# EAGLE design IvoOerlikon2 (EAGLE 7.6.0)
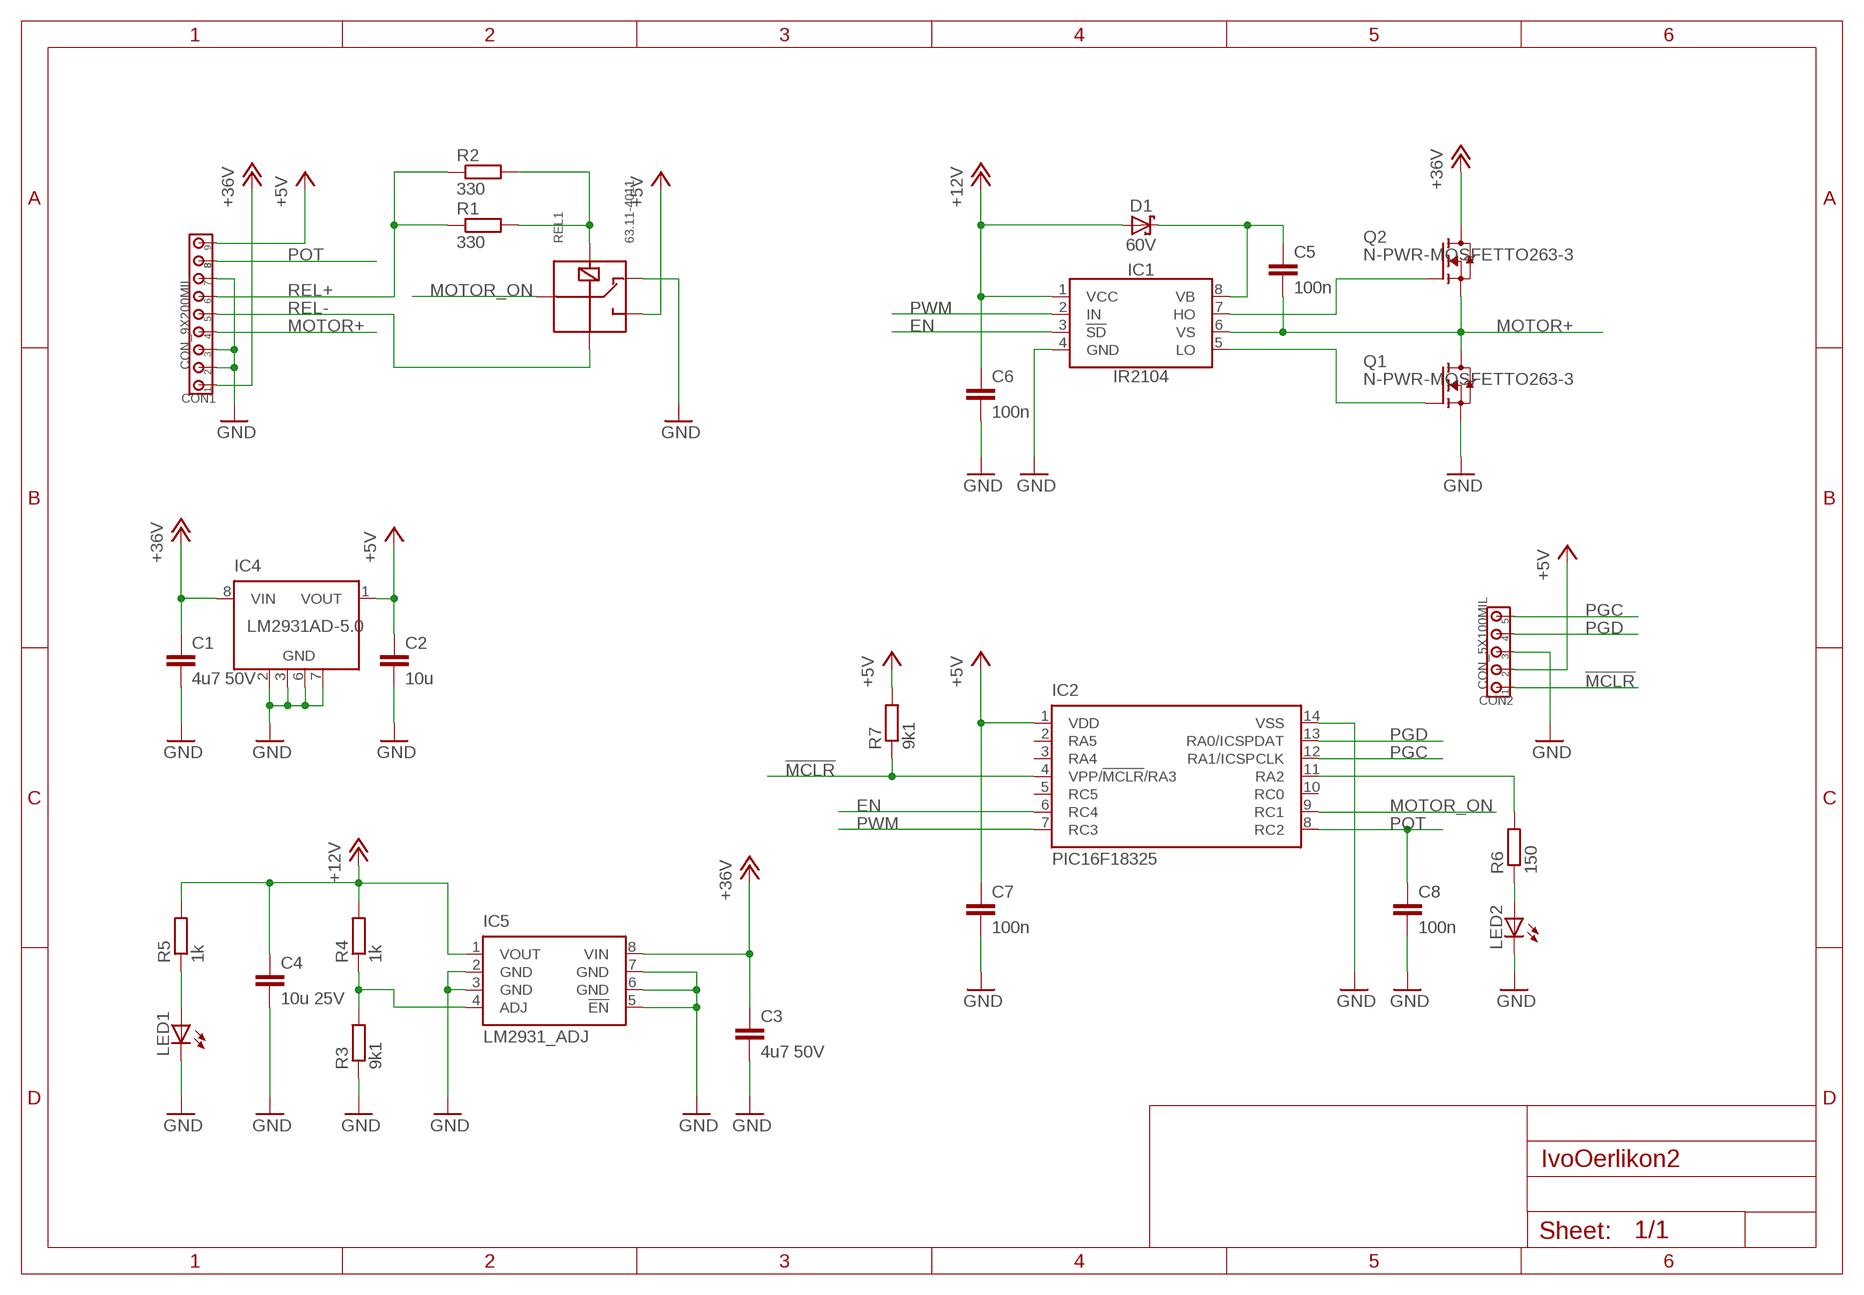
[diagram p0: schematic, sheet 1]

## Parts
C1  4u7 50V  CC1206  [C1206]
C2  10u  CC0805  [C0805]
C3  4u7 50V  CC1206  [C1206]
C4  10u 25V  CC1206  [C1206]
C5  100n  CC0805  [C0805]
C6  100n  CC0805  [C0805]
C7  100n  CC0805  [C0805]
C8  100n  CC0805  [C0805]
CON1  CON_9X200MIL  [200MIL_9X]
CON2  CON_5X100MIL  [100MIL_5X]
D1  60V  SCHOTTKYSOD123  [SOD123]
IC1  IR2104  [SOIC8]
IC2  PIC16F18325  [SO14]
IC4  LM2931AD-5.0  [SOIC8]
IC5  LM2931_ADJ  [SOIC8]
LED1  LED0805  [LED0805]
LED2  LED0805  [LED0805]
Q1  N-PWR-MOSFETTO263-3  [TO263-3]
Q2  N-PWR-MOSFETTO263-3  [TO263-3]
R1  330  RESISTORR1206  [R1206]
R2  330  RESISTORR1206  [R1206]
R3  9k1  RESISTORR0805  [R0805]
R4  1k  RESISTORR0805  [R0805]
R5  1k  RESISTORR0805  [R0805]
R6  150  RESISTORR0805  [R0805]
R7  9k1  RESISTORR0805  [R0805]
REL1  63.11-4011  [G5LE]

## Nets
!MCLR!: CON2.1 IC2.4(VPP/!MCLR!/RA3) R7.1
+5V: C2.1 C7.1 CON1.9 CON2.2 IC2.1(VDD) IC4.1(VOUT) R7.2 REL1.C
+12V: C4.1 C6.1 D1.A IC1.1(VCC) IC5.1(VOUT) R4.2 R5.2
+36V: C1.1 C3.1 CON1.1 IC4.8(VIN) IC5.8(VIN) Q2.TAB(D)
EN: IC1.3(!SD!) IC2.6(RC4)
GND: C1.2 C2.2 C3.2 C4.2 C6.2 C7.2 C8.2 CON1.2 CON1.3 CON1.7 CON2.3 IC1.4(GND) IC2.14(VSS) IC4.2(GND) IC4.3(GND) IC4.6(GND) IC4.7(GND) IC5.2(GND) IC5.3(GND) IC5.5(!EN!) IC5.6(GND) IC5.7(GND) LED1.C LED2.C Q1.3(S) R3.1 REL1.O
MOTOR+: C5.2 CON1.4 IC1.6(VS) Q1.TAB(D) Q2.3(S)
MOTOR_ON: IC2.9(RC1) REL1.COM
N$1: R1.2 R2.2 REL1.2
N$2: IC1.5(LO) Q1.1(G)
N$4: IC5.4(ADJ) R3.2 R4.1
N$5: LED1.A R5.1
N$6: IC1.7(HO) Q2.1(G)
N$8: C5.1 D1.C IC1.8(VB)
N$11: LED2.A R6.1
N$12: IC2.11(RA2) R6.2
PGC: CON2.5 IC2.12(RA1/ICSPCLK)
PGD: CON2.4 IC2.13(RA0/ICSPDAT)
POT: C8.1 CON1.8 IC2.8(RC2)
PWM: IC1.2(IN) IC2.7(RC3)
REL+: CON1.6 R1.1 R2.1
REL-: CON1.5 REL1.1
Unconnected: IC2.2(RA5) IC2.3(RA4) IC2.5(RC5) IC2.10(RC0)

## Library data of the parts
C1-C8 = 00Capacitor:C: Capacitor
CON1 = 00Connector:CON_9X: 9-pin header
CON2 = 00Connector:CON_5X: 5-pin header
D1 = 00Diode:SCHOTTKY
IC1 = 00Logic:IR2104: Half-Bridge Driver Up to +600V Gate drive supply 10-20V Deadtime 520ns
IC2 = 00PIC:PIC16F18325
IC4 = 00VoltageRegulator:LM2931*
IC5 = 00VoltageRegulator:LM2931_ADJ
LED1 LED2 = 00Display:LED: LED
Q1 Q2 = 00Mosfet:N-PWR-MOSFET
R1-R7 = 00Resistor:RESISTOR: RESISTOR, European symbol
REL1 = 00Switch:63.11-4011: SPDT Relay

## Net classes
1 24V: clearance 0.305 mm
2 relay: width 1.778 mm, drill 1.3 mm, clearance 1 mm to class 0, clearance 1 mm to class 1, clearance 1 mm
5 +5v: width 0.61 mm, drill 0.6 mm, clearance 0.254 mm to class 0, clearance 0.254 mm to class 1, clearance 0.254 mm to class 2, clearance 0.254 mm to class 3, clearance 0.254 mm to class 4, clearance 0.254 mm

## Board
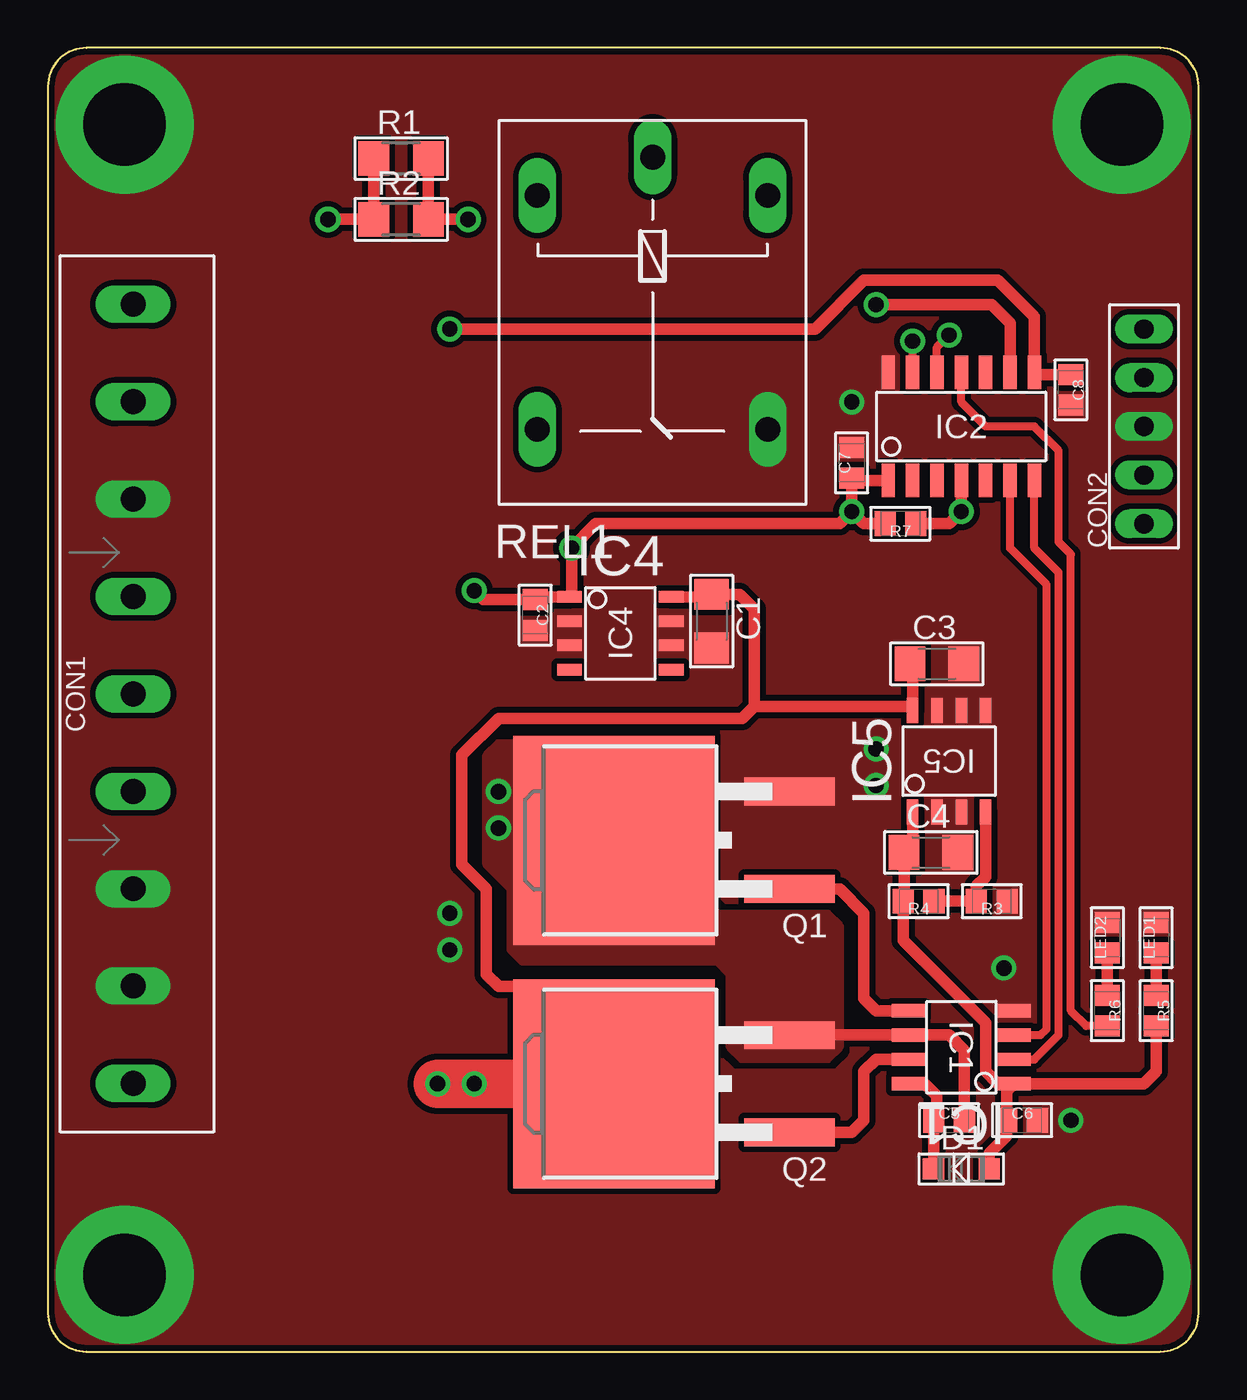
[diagram p1: board, top side]
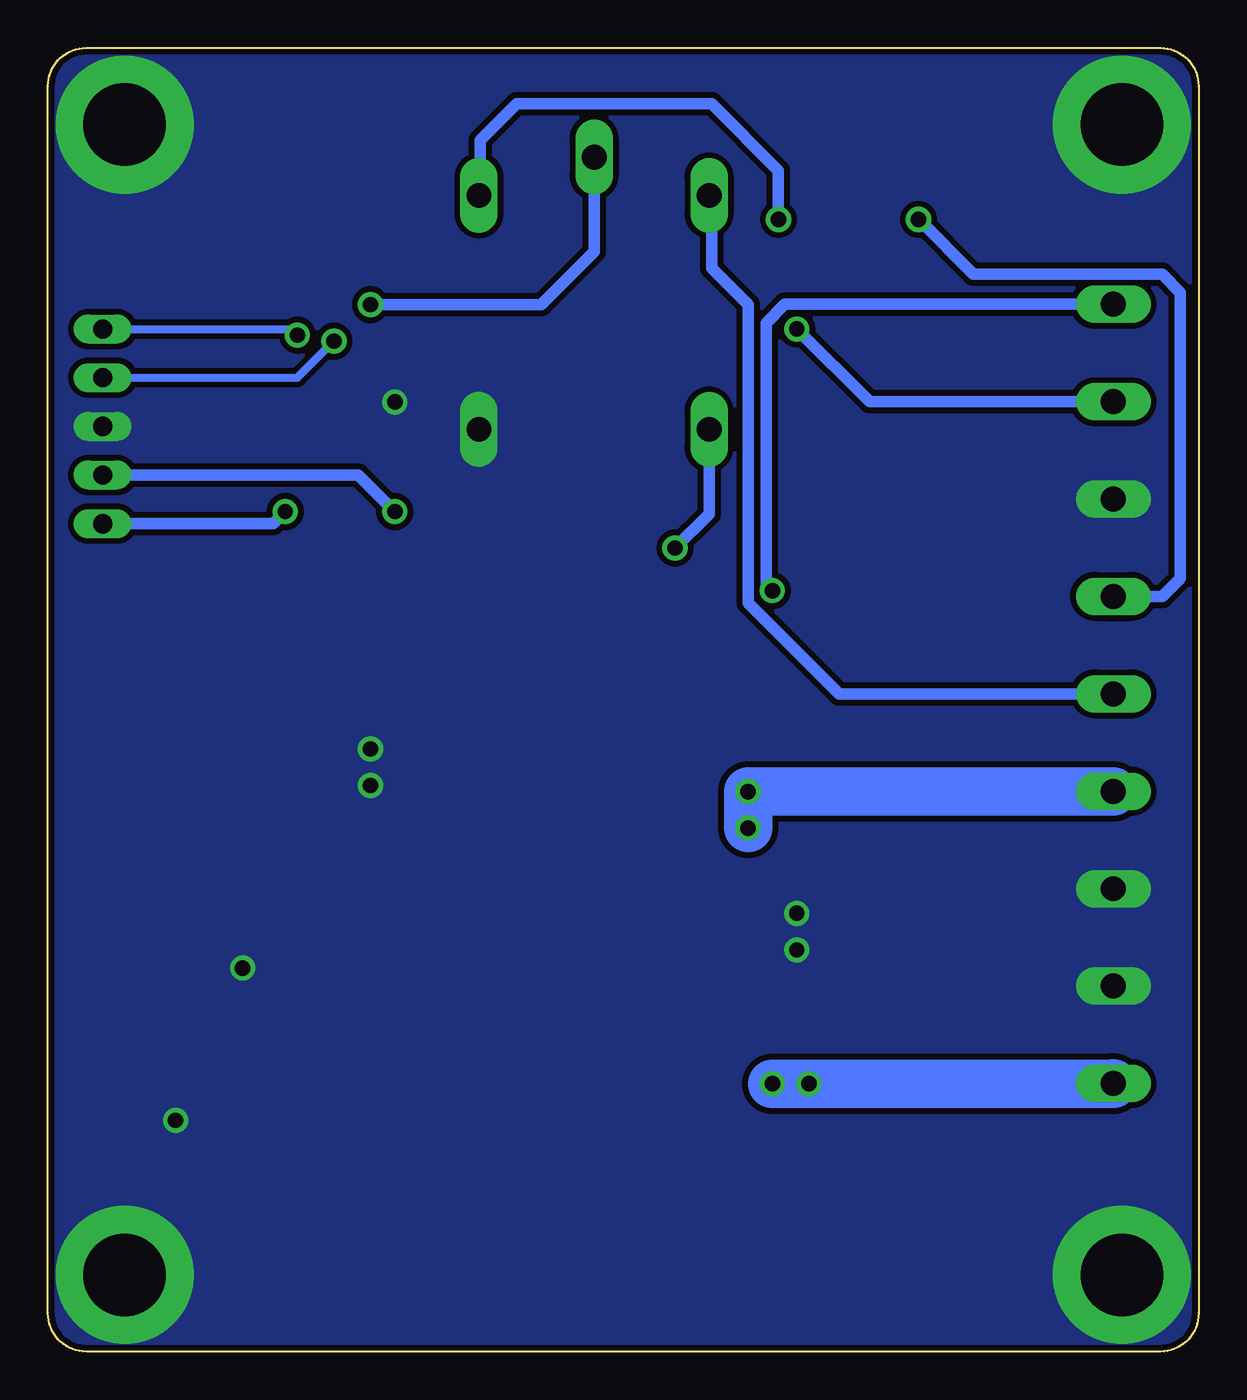
[diagram p2: board, bottom side, seen from below]

Size 60 x 68 mm. Coordinates in mm from the lower left corner, seen from the top.
Outline: 58,0 arc90 60,2 60,66 arc90 58,68 2,68 arc90 0,66 0,2 arc90 2,0 58,0
Copper layers (1*16): Top 0.035mm / dielectric 1.5mm / Bottom 0.035mm
Design rules "LPKF_Compatible": minimum track width 8mil, minimum drill 23mil, track to track 8mil, track to pad 8mil, pad to pad 8mil, via to via 8mil, smd to smd 0mil, copper to edge 10mil, drill to drill 10mil, minimum pad ring 10mil, minimum via ring 10mil, stop-mask expansion 2mil, vias tented up to drill 25mil, thermal gap 10mil

### Footprints (pad centres in the part's own frame; a part is rotated, then mirrored left to right if it is on the bottom)
C1206 = smd 1.6 x 1.8: 1 -1.4,0; 2 1.4,0
C0805 = smd 1.1 x 1.3: 1 -0.8,0; 2 0.8,0
200MIL_9X = drill 1.3 long: 1 -20.32,0; 2 -15.24,0; 3 -10.16,0; 4 -5.08,0; 5 0,0; 6 5.08,0; 7 10.16,0; 8 15.24,0; 9 20.32,0
100MIL_5X = drill 1 long: 1 -5.08,0; 2 -2.54,0; 3 0,0; 4 2.54,0; 5 5.08,0
SOD123 = smd 1.1 x 1.1: A 1.45,0; C -1.45,0
SOIC8 = smd 1.75 x 0.7: 1 -2.75,1.905; 2 -2.75,0.635; 3 -2.75,-0.635; 4 -2.75,-1.905; 5 2.75,-1.905; 6 2.75,-0.635; 7 2.75,0.635; 8 2.75,1.905
SO14 = smd 0.7 x 1.75: 1 -3.81,-2.825; 2 -2.54,-2.825; 3 -1.27,-2.825; 4 0,-2.825; 5 1.27,-2.825; 6 2.54,-2.825; 7 3.81,-2.825; 8 3.81,2.825; 9 2.54,2.825; 10 1.27,2.825; 11 0,2.825; 12 -1.27,2.825; 13 -2.54,2.825; 14 -3.81,2.825
SOIC8' = smd 1.3 x 0.6: 1 -2.65,1.905; 2 -2.65,0.635; 3 -2.65,-0.635; 4 -2.65,-1.905; 5 2.65,-1.905; 6 2.65,-0.635; 7 2.65,0.635; 8 2.65,1.905
LED0805 = smd 1.1 x 1.3: A -0.8,0; C 0.8,0
TO263-3 = smd 1.45 x 4.7: 1 -2.54,-5.65; 3 2.54,-5.65 | smd 10.9 x 10.5: TAB 0,3.5
R1206 = smd 1.6 x 1.803: 1 -1.422,0; 2 1.422,0
R0805 = smd 1.1 x 1.3: 1 -0.8,0; 2 0.8,0
G5LE = drill 1.3 long: 1 -6.1,-6; 2 -6.1,6; C 6.1,-6; COM -8.1,0; O 6.1,6

### Placement (x,y rotation side)
C1  34.61,38.1 270 top
C2  25.4,38.42 270 top
C3  46.35,35.88 0 top
C4  46.04,26.04 0 top
C5  46.99,12.06 0 top
C6  50.8,12.06 0 top
C7  41.91,46.35 90 top
C8  53.34,50.16 270 top
CON1  4.45,34.3 90 top
CON2  57.15,48.26 90 top
D1  47.62,9.53 0 top
IC1  47.62,15.88 180 top
IC2  47.62,48.26 0 top
IC4  LM2931AD-5.0  [SOIC8']  29.84,37.47 0 top
IC5  LM2931_ADJ  [SOIC8']  46.99,30.8 90 top
LED1  57.78,21.59 90 top
LED2  55.24,21.59 90 top
Q1  33.02,26.67 90 top
Q2  33.02,13.97 90 top
R1  18.41,62.23 0 top
R2  18.41,59.05 0 top
R3  49.21,23.5 180 top
R4  45.4,23.5 180 top
R5  57.78,17.78 270 top
R6  55.24,17.78 270 top
R7  44.45,43.18 180 top
REL1  31.52,54.2 270 top

### Tracks (layer width: path | path; a pad name or v marks a point on that pad's centre or on a via)
!MCLR!  (via drill 0.8)
  Top 0.61: R7.1 46.99,43.18 v47.62,43.81 IC2.4
  Bottom 0.61: CON2.1 48.26,43.18 v47.62,43.81
+5V  (via drill 0.8)
  Top 0.61: IC2.1 42.03,45.44 C7.1 v41.91,43.81 | v41.91,43.81 41.27,43.18 28.57,43.18 v27.3,41.91 27.3,39.48 IC4.1 25.55,39.37 C2.1 22.7,39.22 v22.23,39.69 | v41.91,43.81 42.55,43.18 R7.2
  Bottom 0.61: CON1.9 21.57,54.62 22.54,53.66 22.54,40.01 v22.23,39.69 | REL1.C 25.52,43.69 v27.3,41.91 | CON2.2 43.81,45.72 v41.91,43.81
+12V
  Top 0.61: IC1.1 50,13.6 C6.1 50,11.27 49.08,10.34 D1.A | IC1.1 57.15,13.97 57.78,14.61 R5.2 | IC1.1 49.53,13.97 48.9,14.61 48.9,17.14 44.6,21.44 R4.2 44.64,23.53 C4.1 45.09,26.48 IC5.1
+36V  (via drill 0.8)
  Top 0.61: Q2.TAB 29.52,14.29 24.77,19.05 23.5,19.05 22.86,19.68 22.86,24.13 21.59,25.4 21.59,31.11 23.5,33.02 36.2,33.02 36.83,33.66 | IC4.8 34.48,39.37 C1.1 36.06,39.5 36.83,38.73 36.83,33.66 | C3.1 45.09,35.75 IC5.8 44.88,33.66 36.83,33.66
  Top 2.54: v20.32,13.97 v22.23,13.97 Q2.TAB
  Bottom 2.54: CON1.1 v20.32,13.97 v22.23,13.97
EN
  Top 0.406: IC1.3 51.75,16.51 52.07,16.83 52.07,40.01 50.16,41.91 IC2.6
GND  (via drill 0.8, 4.3 pad 7.2)
  other vias: 4,64 56,64 56,4 4,4 20.95,22.86 20.95,20.95 43.18,31.43 43.18,29.53 49.85,20 53.34,12.06 41.91,49.53
  pour Bottom (isolate 0.305, rank 3, no thermals): 58,0 2,0 arc-90 0,2 0,66 arc-90 2,68 58,68 arc-90 60,66 60,2 arc-90
  pour Top (isolate 0.305, rank 3, no thermals): 0,2 0,66 arc-90 2,68 58,68 arc-90 60,66 60,2 arc-90 58,0 2,0 arc-90
MOTOR+  (via drill 0.8)
  Top 0.61: C5.2 47.79,15.71 46.99,16.51 IC1.6 Q2.3
  Bottom 2.54: CON1.4 4.46,29.21 v23.5,29.21 v23.5,27.3
  pour Top (no thermals): 23.5,31.75 34.29,31.75 34.29,23.5 34.92,22.86 40.64,22.86 41.27,22.23 41.27,15.88 40.64,15.24 36.2,15.24 35.56,15.88 35.56,19.68 34.92,20.32 24.77,20.32 24.13,20.95 24.13,24.13 22.86,25.4 22.86,31.11
MOTOR_ON  (via drill 0.8)
  Top 0.61: IC2.9 50.16,53.66 49.21,54.61 v43.18,54.61
  Bottom 0.61: REL1.COM 31.52,57.38 34.29,54.61 v43.18,54.61
N$1  (via drill 0.8)
  Top 0.61: R1.2 R2.2 v21.91,59.05
  Bottom 0.61: v21.91,59.05 21.91,61.59 25.4,65.09 35.56,65.09 37.47,63.18 37.47,60.37 REL1.2
N$2
  Top 0.61: IC1.5 43.18,17.78 42.55,18.41 42.55,22.86 41.27,24.13 Q1.1
N$4
  Top 0.61: R4.1 R3.2 48.41,24.28 48.9,24.77 IC5.4
N$5
  Top 0.61: R5.1 LED1.A
N$6
  Top 0.61: Q2.1 41.91,11.43 42.55,12.06 42.55,14.61 43.18,15.24 IC1.7
N$8
  Top 0.61: IC1.8 45.72,13.97 46.35,13.34 46.35,12.23 C5.1 46.19,9.54 D1.C
N$11
  Top 0.61: LED2.A R6.1
N$12
  Top 0.406: R6.2 54.14,16.98 53.34,17.78 53.34,41.59 52.7,42.23 52.7,46.99 51.44,48.26 48.9,48.26 47.62,49.53 IC2.11
PGC  (via drill 0.8)
  Top 0.406: IC2.12 46.35,52.39 v46.99,53.02
  Bottom 0.406: CON2.5 47.31,53.34 v46.99,53.02
PGD  (via drill 0.8)
  Top 0.406: IC2.13 v45.09,52.7
  Bottom 0.406: CON2.4 46.99,50.8 v45.09,52.7
POT  (via drill 0.8)
  Top 0.61: v20.95,53.34 40.01,53.34 42.55,55.88 49.53,55.88 51.44,53.98 IC2.8 51.55,50.97 C8.1
  Bottom 0.61: CON1.8 17.16,49.55 v20.95,53.34
PWM
  Top 0.406: IC1.2 51.44,15.24 52.7,16.51 52.7,40.64 51.44,41.91 IC2.7
REL+  (via drill 0.8)
  Top 0.61: v14.61,59.05 R2.1 R1.1
  Bottom 0.61: CON1.6 1.89,39.38 0.95,40.32 0.95,55.24 1.91,56.2 11.75,56.2 v14.61,59.05
REL-
  Bottom 0.61: CON1.5 18.75,34.3 23.5,39.05 23.5,54.61 25.4,56.52 25.4,60.18 REL1.1

### Text on the board
tText: Pot+ | PotWiper | Pot- | Rel+ | Rel- | Motor+ | Motor- | Feed | Power | GND | 36V | Ivo's Oerlikon